# Altium project smart-ppe.PrjPcb (part 3 of 3)
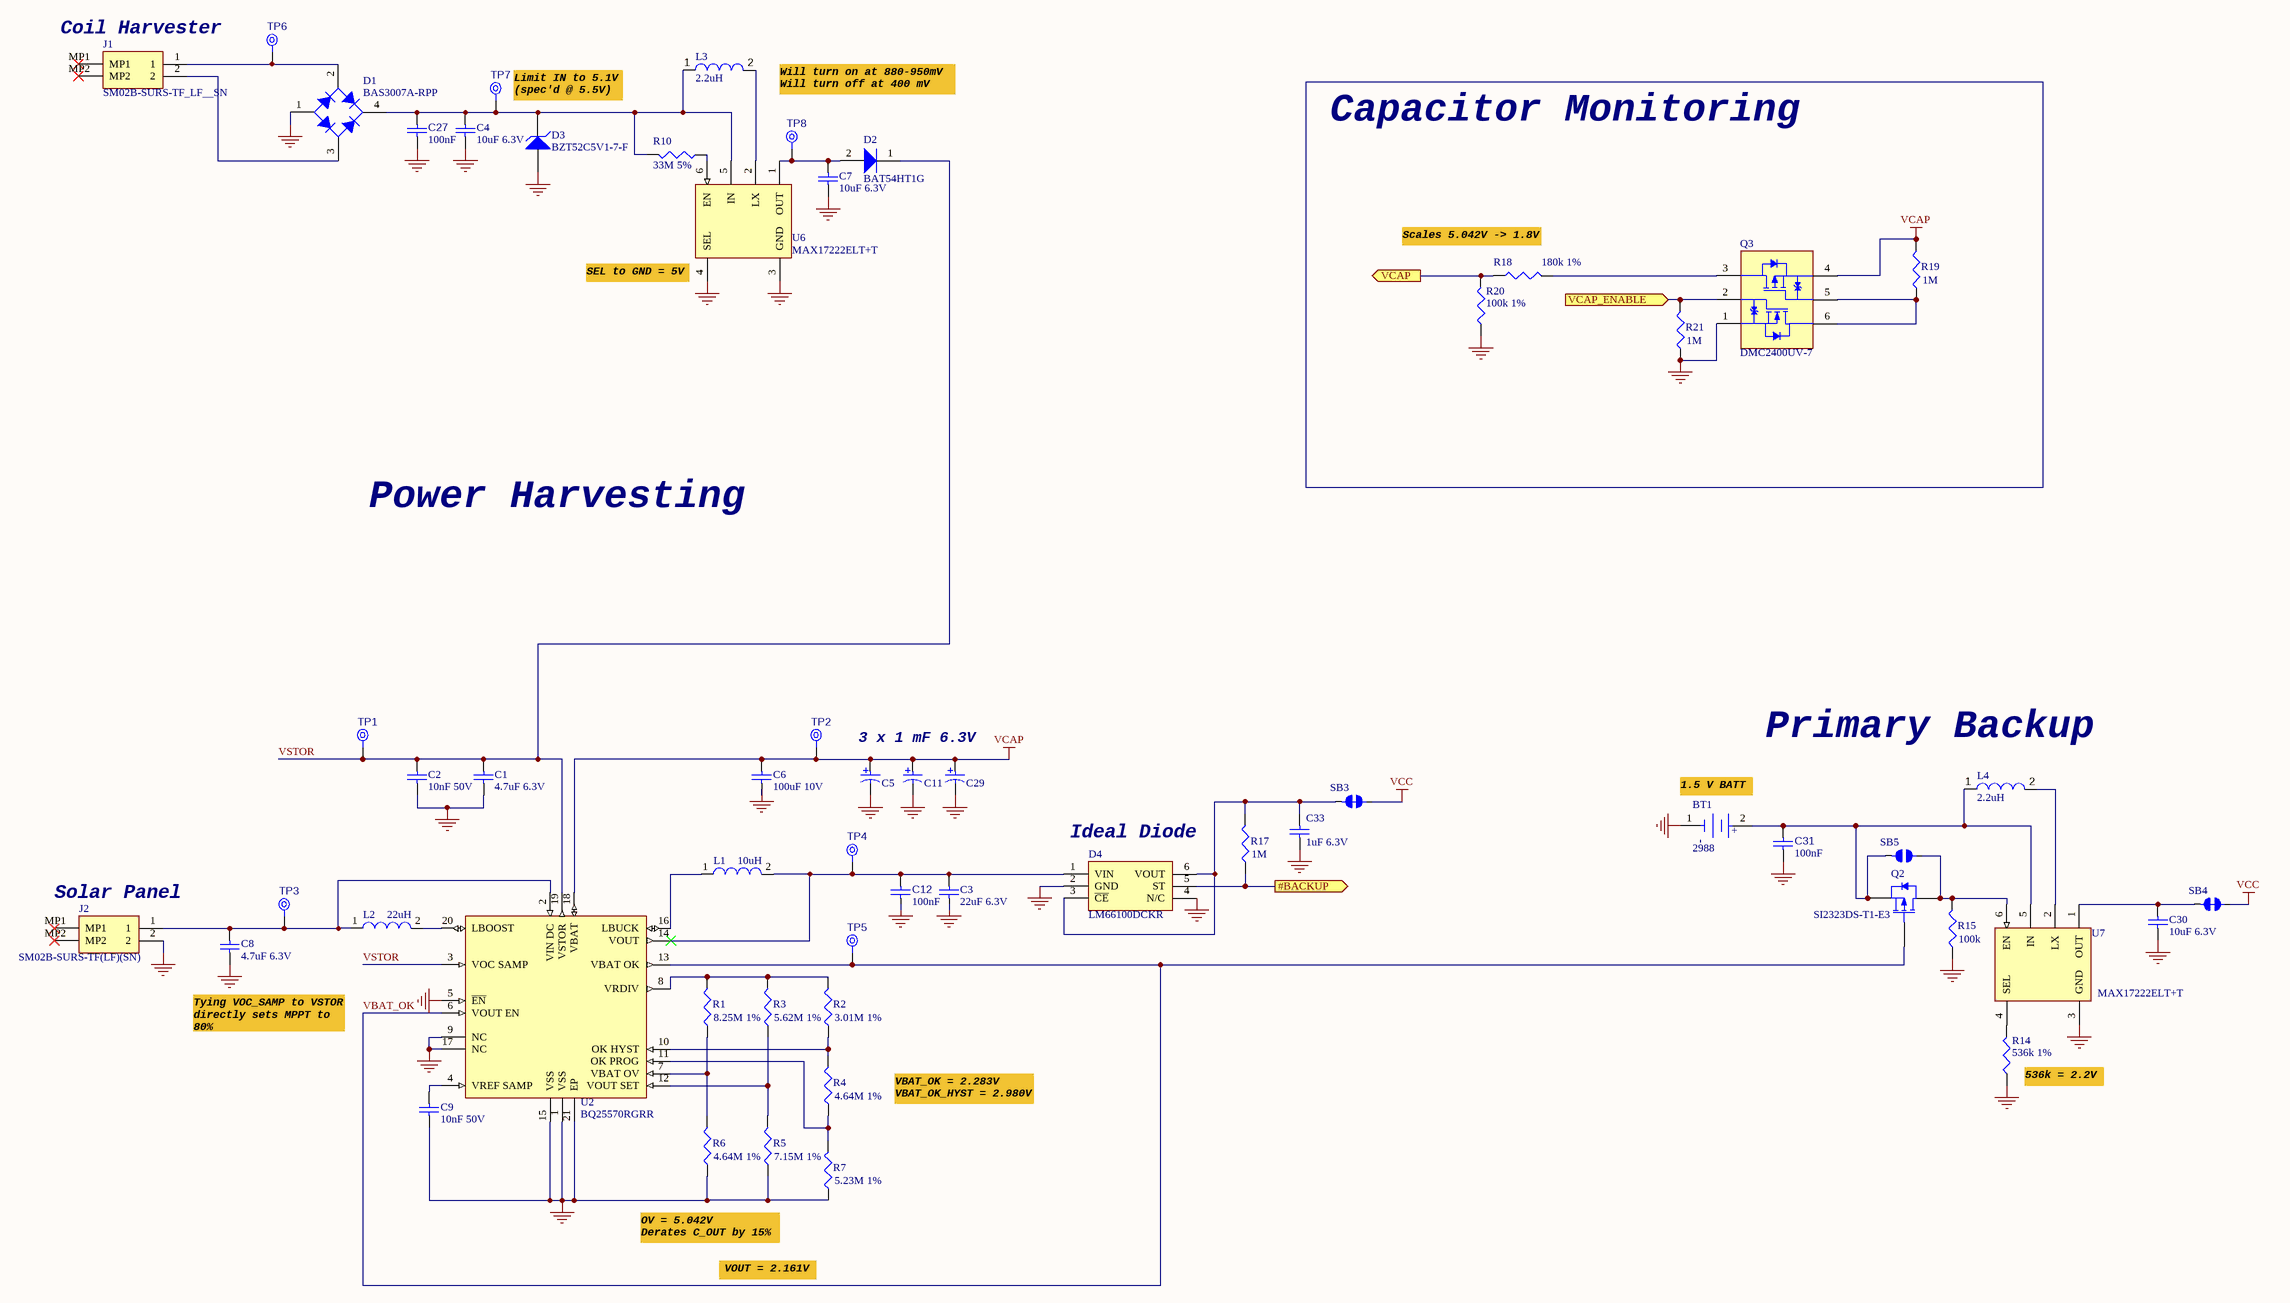
[diagram p5: Power.SchDoc]

## Nets that join several sheets
GND: MCU (21 pins), Memory (C10.2 U10.4), Sensors (34 pins), Power (39 pins)
VCC: MCU (7 pins), Power (SB3.2 SB4.2)
I2S_SCK: MCU (U1.18), Sensors (MK1.4)
MISO: MCU (U1.13), Memory (U10.2), Sensors (U3.1 U4.4 U5.5)
MOSI: MCU (U1.9), Memory (U10.5), Sensors (U3.14 U5.4)
NetC10_1: MCU (U1.14), Memory (C10.1 U10.3 U10.7 U10.8)
NetC13_1: MCU (U1.22), Sensors (5 pins)
NetC16_1: MCU (U1.17), Sensors (C16.1 C17.1 U3.5 U3.8)
NetC19_1: MCU (U1.6), Sensors (C19.1 MK1.5)
NetC20_1: MCU (U1.16), Sensors (C20.1 C21.1 U5.1 U5.10)
NetC22_1: MCU (U1.34), Sensors (C22.1 U8.5)
NetC24_2: MCU (U1.31), Sensors (C24.2 R8.1 U9.5)
NetC32_1: MCU (Q1.3), Sensors (C32.1 J3.1)
NetD4_5: MCU (U1.29), Power (D4.5 R17.1)
NetQ3_2: MCU (U1.21), Power (Q3.2 R21.2)
NetR18_1: MCU (U1.44), Power (R18.1 R20.2)
NetU1_10: MCU (U1.10), Sensors (U5.6)
NetU1_12: MCU (U1.12), Memory (U10.1)
NetU1_27: MCU (U1.27), Sensors (U4.7)
NetU1_28: MCU (U1.28), Sensors (U4.3)
NetU1_30: MCU (U1.30), Sensors (U3.12)
NetU1_41: MCU (U1.41), Sensors (U3.4)
NetU1_42: MCU (U1.42), Sensors (U5.7)
SCK: MCU (U1.11), Memory (U10.6), Sensors (U3.13 U4.1 U5.2)
SCL: MCU (R12.1 U1.33), Sensors (J3.3 U8.6 U9.3)
SD: MCU (U1.19), Sensors (MK1.6 R13.2)
SDA: MCU (R11.1 U1.32), Sensors (J3.5 U8.1 U9.6)
WS: MCU (U1.20), Sensors (MK1.1)

## Assembly variants
v0.1: not fitted R9